# EAGLE design nerdstern (EAGLE 6.4)
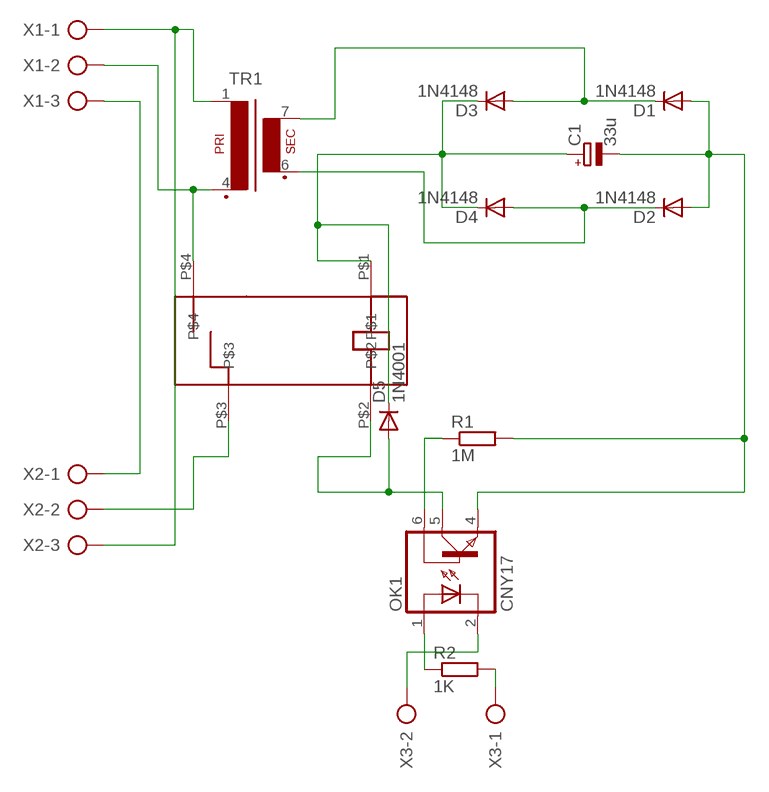
[diagram p0: schematic, sheet 1]

## Parts
C1  33u  CPOL-EUE2-5  [E2-5]
D1  1N4148  1N4148DO35-7  [DO35-7]
D2  1N4148  1N4148DO35-7  [DO35-7]
D3  1N4148  1N4148DO35-7  [DO35-7]
D4  1N4148  1N4148DO35-7  [DO35-7]
D5  1N4001  1N4148DO35-7  [DO35-7]
OK1  CNY17  [DIL06]
R1  1M  R-EU_0204/5  [0204/5]
R2  1K  R-EU_0204/5  [0204/5]
TR1  EE20-1  [EE20-1]
U$1  JS_05_MN_KT  [JS_05_MN_KT]
X1  AK500/3  [AK500/3]
X2  AK500/3  [AK500/3]
X3  AK500/2  [AK500/2]

## Nets
GND: C1.- D1.A D2.A OK1.4(EMI) R1.2
GND2: X1.3 X2.1
N$1: TR1.4(P2) U$1.P$4 X1.2
N$2: U$1.P$3 X2.2
N$3: TR1.1 X1.1 X2.3
N$4: D1.C D3.A TR1.7(S4)
N$5: C1.+ D3.C D4.C D5.C U$1.P$1
N$6: D5.A OK1.5(COL) U$1.P$2
N$7: D2.C D4.A TR1.6(S3)
N$10: OK1.1(A) R2.1
N$11: OK1.2(C) X3.2
N$14: OK1.6(BAS) R1.1
N$15: R2.2 X3.1

## Library data of the parts
C1 = rcl:CPOL-EU: POLARIZED CAPACITOR, European symbol
D1-D5 = diode:1N4148: DIODE high speed (Philips)
OK1 = optocoupler:CNY17: SIEMENS OPTO COUPLER; MPN: CNY17-1; OC_FARNELL: 1045399; OC_NEWARK: 05M4044
R1 R2 = rcl:R-EU_: RESISTOR, European symbol
TR1 = trafo:EE20-1: TRANSFORMER 1 primary winding, 1 secondary winding ERA
U$1 = n39:JS_05_MN_KT
X1 X2 = con-ptr500:AK500/3: CONNECTOR; OC_FARNELL: unknown; OC_NEWARK: unknown
X3 = con-ptr500:AK500/2: CONNECTOR; OC_FARNELL: unknown; OC_NEWARK: unknown

## Board
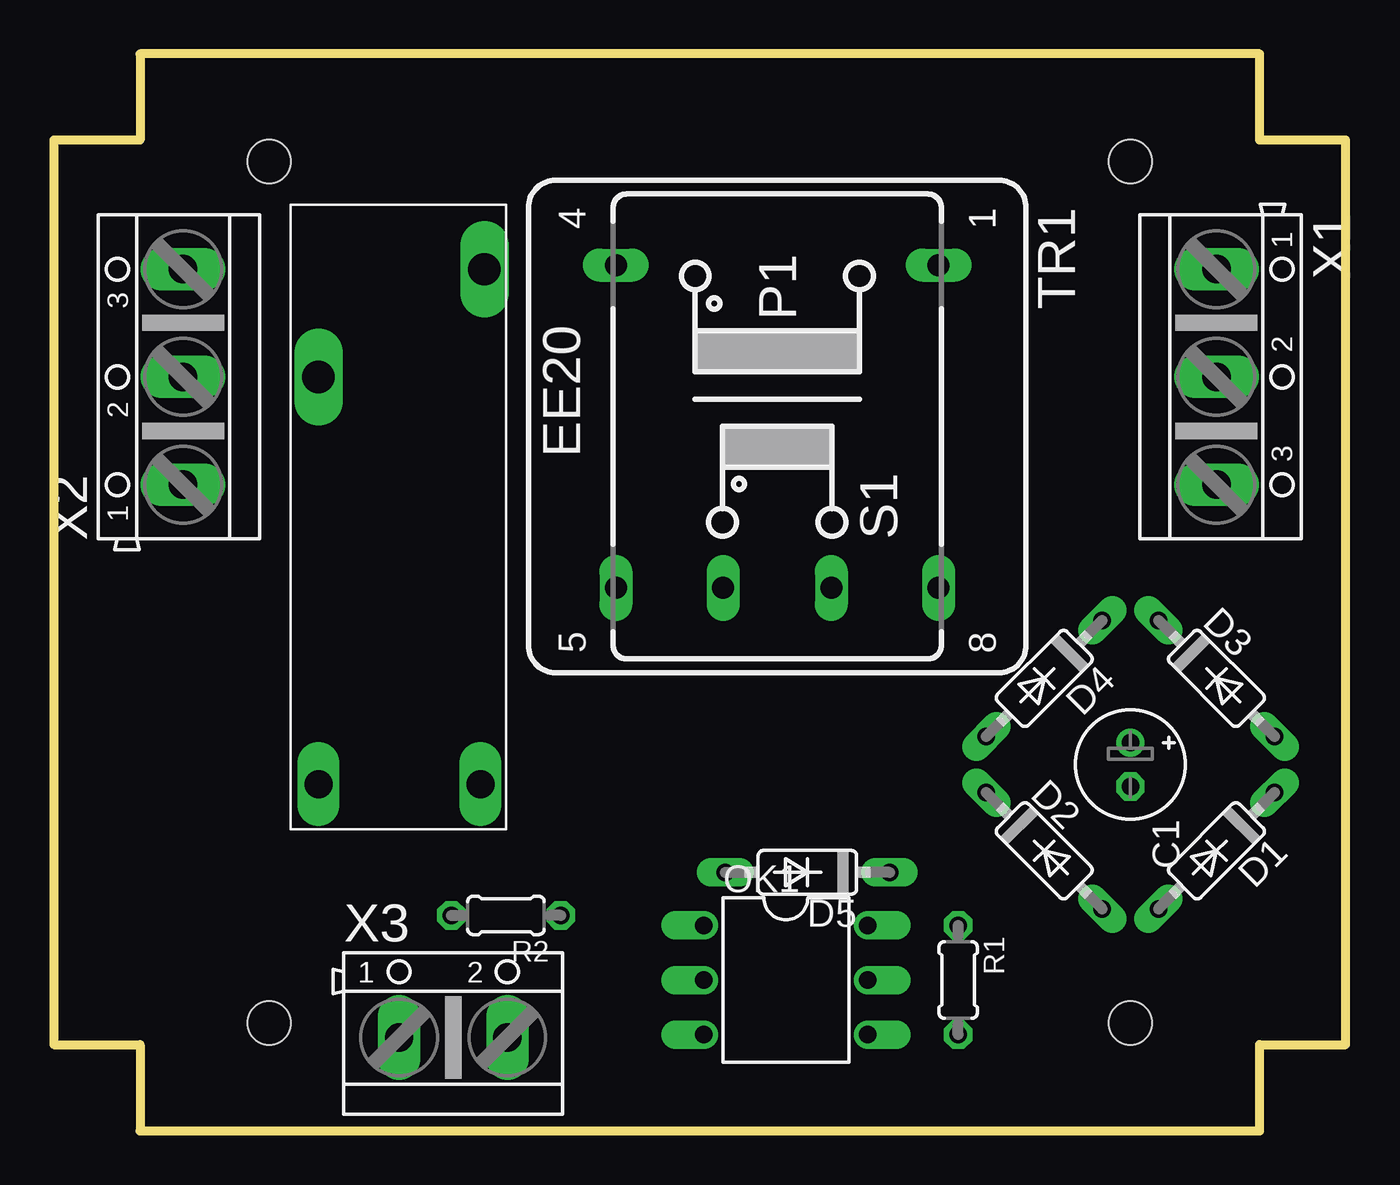
[diagram p1: board, top side]
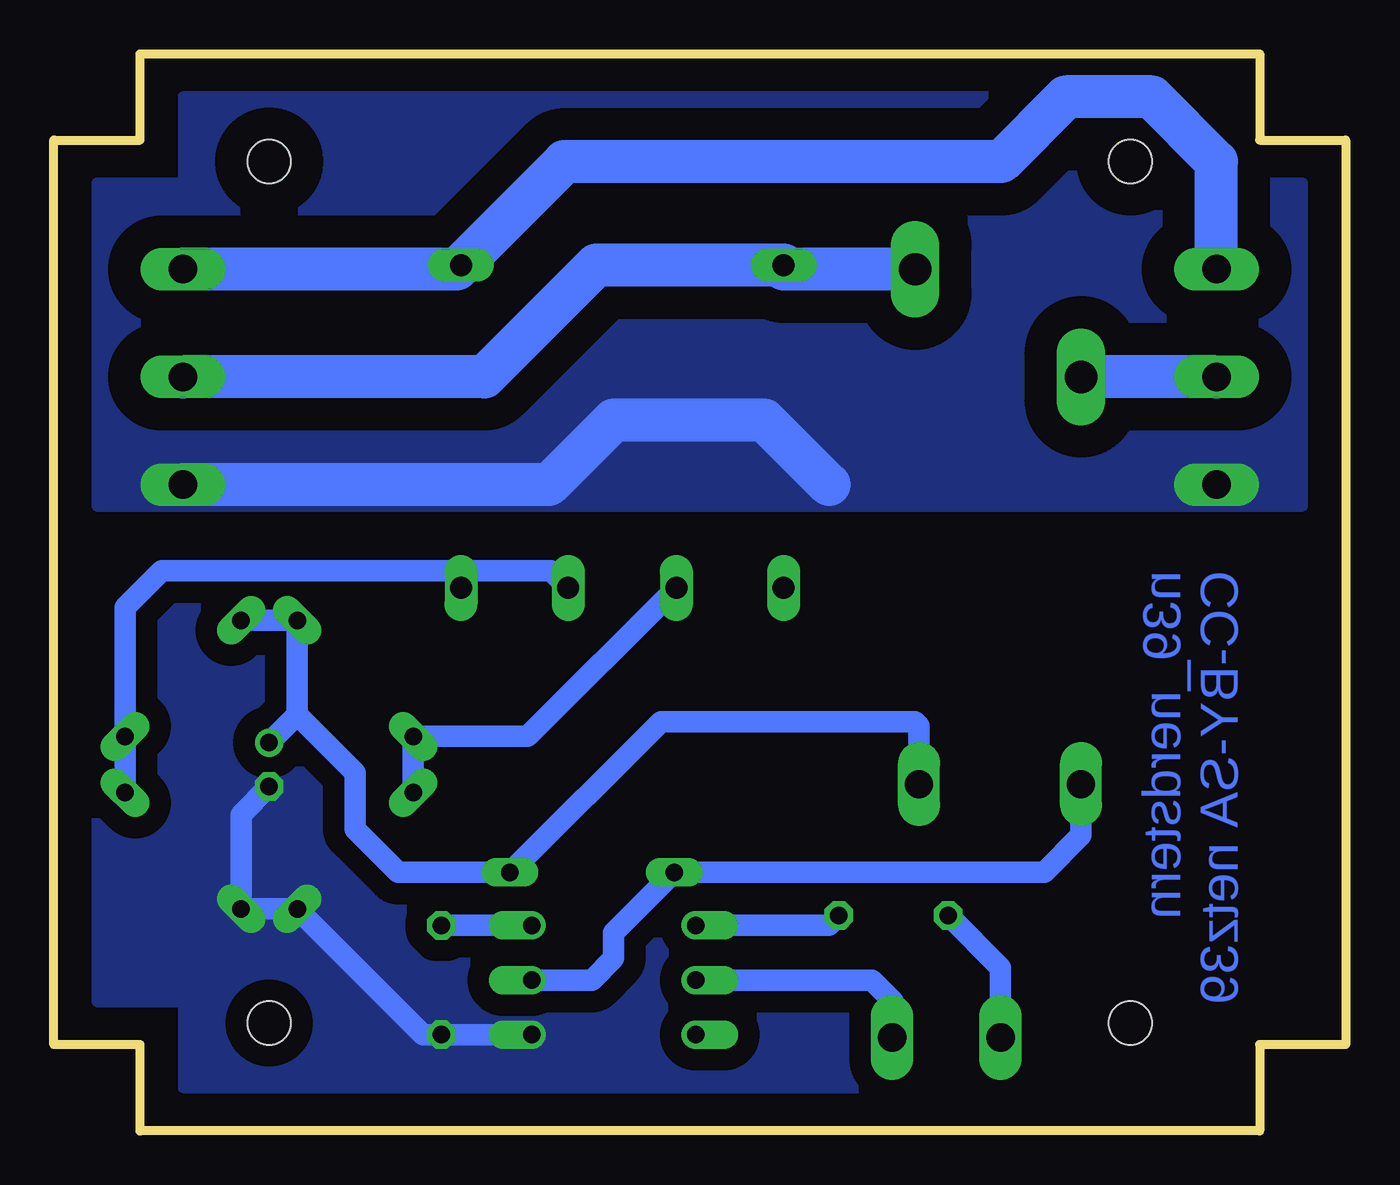
[diagram p2: board, bottom side, seen from below]

Size 60 x 50 mm. Coordinates in mm from the lower left corner, seen from the top.
Outline: 0,4 4,4 4,0 56,0 56,4 60,4 60,46 56,46 56,50 4,50 4,46 0,46 0,4
Copper layers (1*16): Top 0.035mm / dielectric 1.5mm / Bottom 0.035mm
Design rules "default": minimum track width 10mil, minimum drill 24mil, track to track 8mil, track to pad 8mil, pad to pad 8mil, via to via 8mil, smd to smd 8mil, copper to edge 40mil, drill to drill 8mil, minimum pad ring 10mil, minimum via ring 8mil, stop-mask expansion 4mil, vias tented up to drill 0mil, thermal gap 10mil
Holes 2 mm at 10,5 50,5 50,45 10,45

### Footprints (pad centres in the part's own frame; a part is rotated, then mirrored left to right if it is on the bottom)
E2-5 = drill 0.813 pad 1.27: + -1.016,0 | drill 0.813 pad 1.27 octagon: - 1.016,0
DO35-7 = drill 0.813 long: A 3.81,0; C -3.81,0
DIL06 = drill 0.813 offset: 1 -2.54,-3.81; 2 0,-3.81; 3 2.54,-3.81; 4 2.54,3.81; 5 0,3.81; 6 -2.54,3.81
0204/5 = drill 0.813 octagon: 1 -2.54,0; 2 2.54,0
EE20-1 = drill 1.016 long: 1 -7.493,7.493; 4 -7.493,-7.493; 5 7.493,-7.493; 6 7.493,-2.515; 7 7.493,2.515; 8 7.493,7.493
JS_05_MN_KT = drill 1.3 long: P$1 2.1,1.19; P$2 2.1,8.71 | drill 1.5 long: P$3 21,8.71; P$4 26,1
AK500/3 = drill 1.321 long: 1 -5.004,0; 2 0,0; 3 5.004,0
AK500/2 = drill 1.321 long: 1 -2.515,0; 2 2.515,0

### Placement (x,y rotation side)
C1  50,17 270 top
D1  54,13 225 top
D2  46,13 315 top
D3  54,21 315 top
D4  46,21 225 top
D5  35,12 180 top
OK1  34,7 270 top
R1  42,7 270 top
R2  21,10 180 top
TR1  33.6,32.7 270 top
U$1  21,14 90 top
X1  54,35 270 top
X2  6,35 90 top
X3  18.55,4.33 0 top

### Tracks (layer width: path | path; a pad name or v marks a point on that pad's centre or on a via)
GND
  Bottom 1: OK1.4 R1.2 42.85,4.46 D2.A D1.A 51.31,14.68 C1.-
  pour Bottom (isolate 1, no thermals): 2,26 58,26 58,6 54,6 54,2 6,2 6,6 2,6
GND2
  Bottom 2: 24,30 27,33 34,33 37,30 X1.3
  pour Bottom (isolate 1.5, no thermals): 6,48 54,48 54,44 58,44 58,29 2,29 2,44 6,44 6,47
N$1
  Bottom 2: U$1.P$4 26.11,40 TR1.4 34.81,40.19 40,35 X1.2
N$2
  Bottom 2: X2.2 U$1.P$3
N$3
  Bottom 2: X1.1 41.28,40 TR1.1 36.29,45 16,45 13,48 9,48 6,45 X2.3
N$4
  Bottom 1: TR1.7 36.91,26 55,26 56.69,24.31 D3.A D1.C
N$5
  Bottom 1: D3.C D4.C 48.69,19.32 | 48.69,19.32 C1.+ | 48.69,19.32 46,16.63 46,14 44,12 D5.C 31.81,19 20,19 19.81,18.81 U$1.P$1
N$6
  Bottom 1: OK1.5 35,7 34,8 34,9.19 D5.A 14,12 12.29,13.71 U$1.P$2
N$7
  Bottom 1: D2.C D4.A 37.99,18.31 TR1.6
N$10
  Bottom 1: R2.1 24,9.54 OK1.1
N$11
  Bottom 1: X3.2 21.07,5.93 21,6 22,7 OK1.2
N$14
  Bottom 1: OK1.6 R1.1
N$15
  Bottom 1: X3.1 16.04,7.58 R2.2

### Text on the board
Bottom: n39_nerdstern / CC-BY-SA netz39